# EAGLE design tracker (EAGLE 7.2.0)
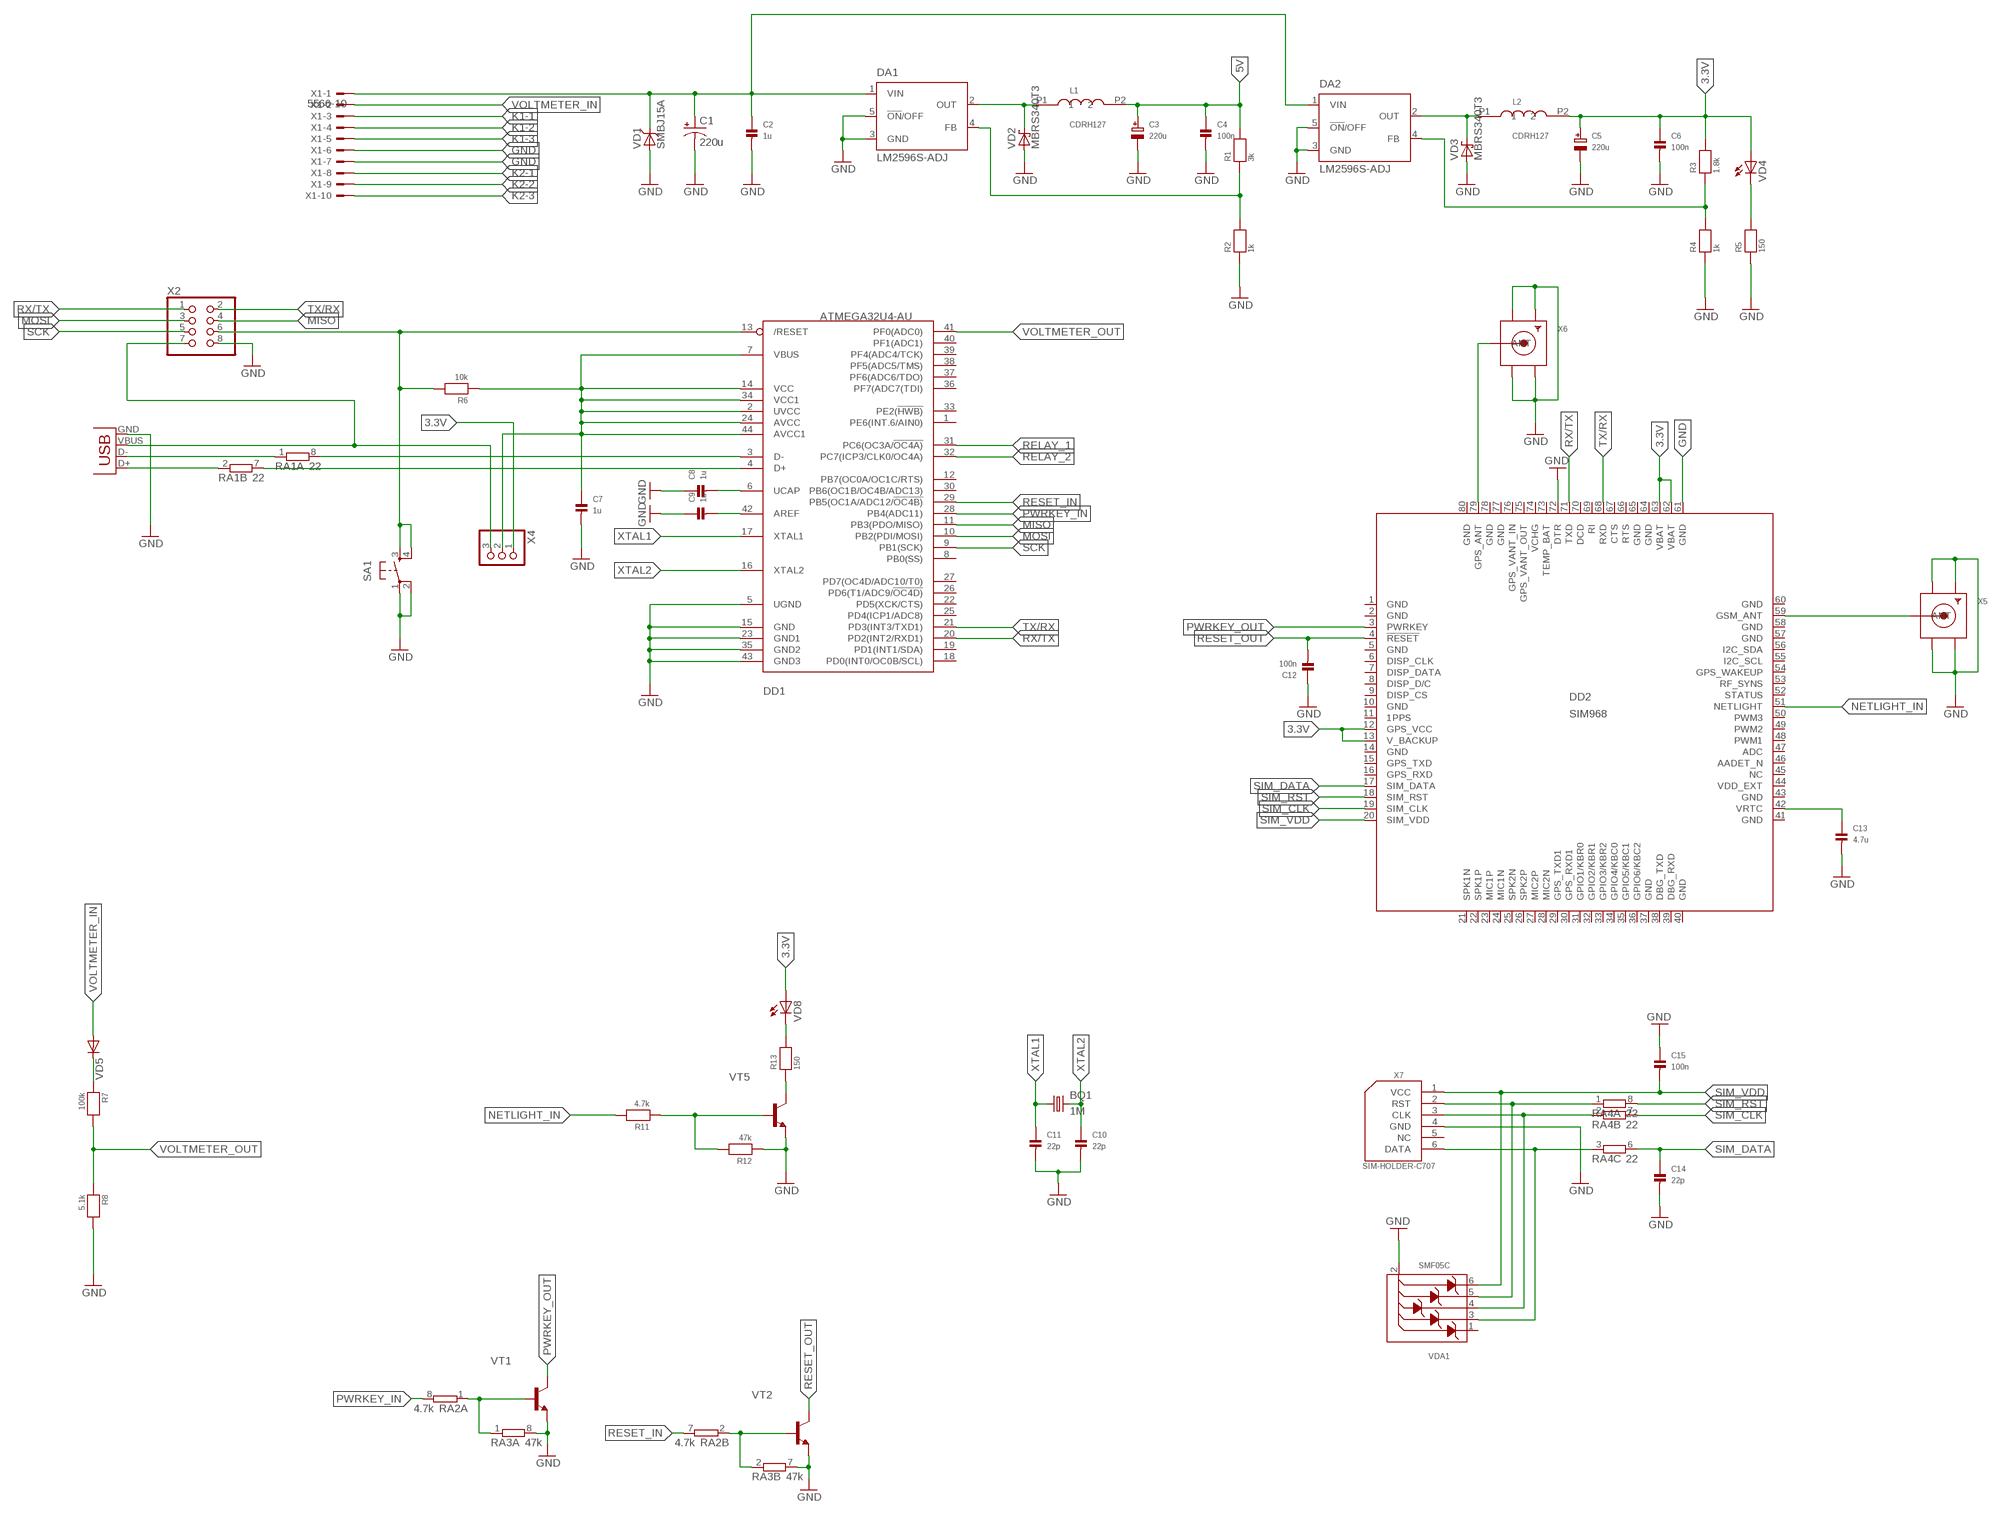
[diagram p0: schematic, sheet 1, part 1 of 2]
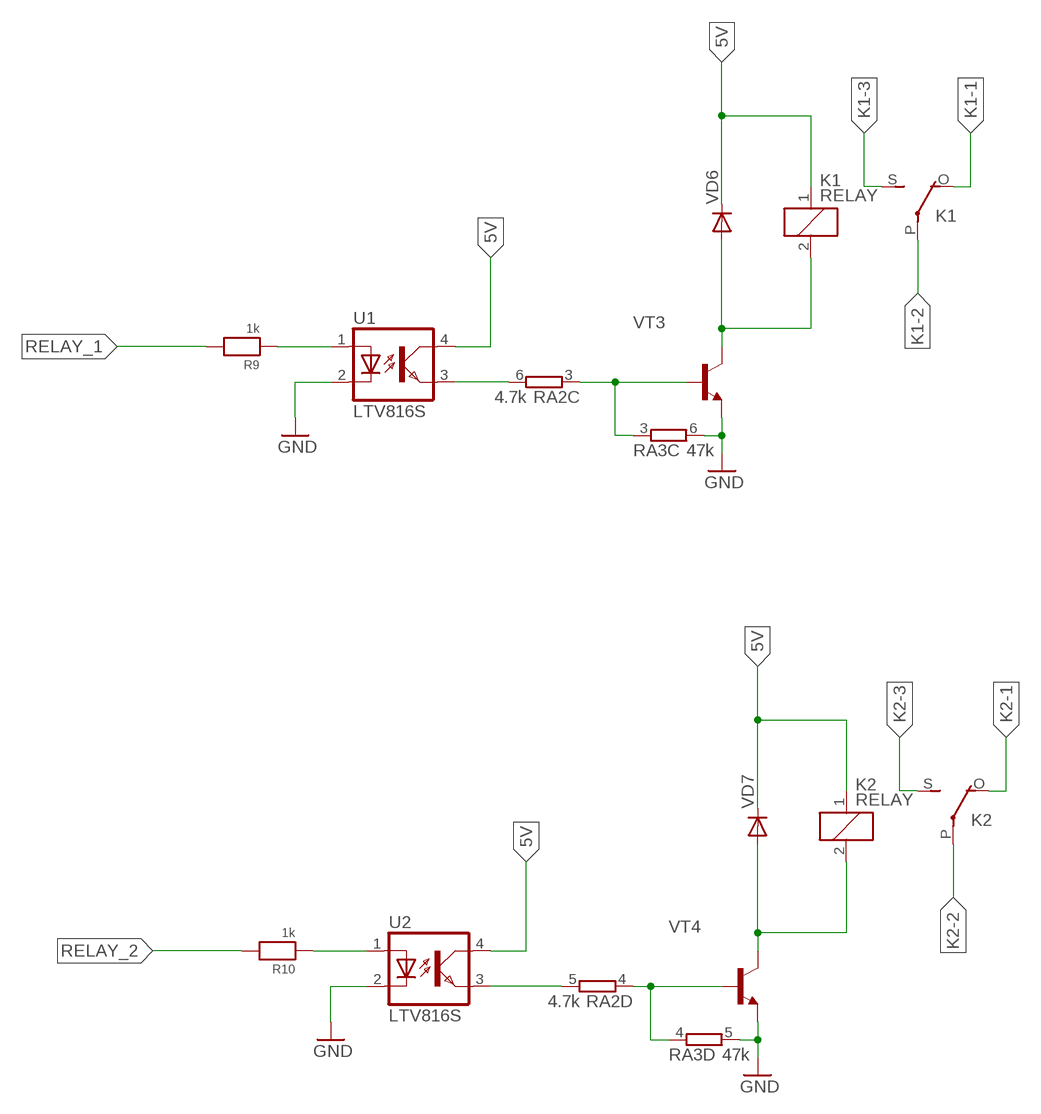
[diagram p1: schematic, sheet 1, part 2 of 2]

## Parts
BQ1  1M  CRYSTALSM49  [SM49]
C1  220u  CAP_POLG  [PANASONIC_G]
C2  1u  CAP_CERAMIC_0805  [_0805]
C3  220u  CAP_TANTALUMD/7343_WAVE  [EIA7343-31/D-W]
C4  100n  CAP_CERAMIC_0603  [_0603]
C5  220u  CAP_TANTALUMD/7343_WAVE  [EIA7343-31/D-W]
C6  100n  CAP_CERAMIC_0603  [_0603]
C7  1u  CAP_CERAMIC_0805  [_0805]
C8  1u  CAP_CERAMIC_0805  [_0805]
C9  1u  CAP_CERAMIC_0805  [_0805]
C10  22p  CAP_CERAMIC_0805  [_0805]
C11  22p  CAP_CERAMIC_0805  [_0805]
C12  100n  CAP_CERAMIC_0603  [_0603]
C13  4.7u  CAP_CERAMIC_0805  [_0805]
C14  22p  CAP_CERAMIC_0805  [_0805]
C15  100n  CAP_CERAMIC_0603  [_0603]
DA1  LM2596S-ADJ  LM2596S  [TO263-5]
DA2  LM2596S-ADJ  LM2596S  [TO263-5]
DD1  ATMEGA32U4-AU  [TQFP44]
DD2  SIM968  [SIM968]
K1  RELAY  [RELAY]
K2  RELAY  [RELAY]
L1  CDRH127  [CDRH127]
L2  CDRH127  [CDRH127]
R1  3k  RESISTOR_0805  [_0805]
R2  1k  RESISTOR_0805  [_0805]
R3  1.8k  RESISTOR_0805  [_0805]
R4  1k  RESISTOR_0805  [_0805]
R5  150  RESISTOR_0805  [_0805]
R6  10k  RESISTOR_0805  [_0805]
R7  100k  RESISTOR_0805  [_0805]
R8  5.1k  RESISTOR_0805  [_0805]
R9  1k  RESISTOR_0805  [_0805]
R10  1k  RESISTOR_0805  [_0805]
R11  4.7k  RESISTOR_0805  [_0805]
R12  47k  RESISTOR_0805  [_0805]
R13  150  RESISTOR_0805  [_0805]
RA1  22  4R-NCAY16  [CAY16]
RA2  4.7k  4R-NCAY16  [CAY16]
RA3  47k  4R-NCAY16  [CAY16]
RA4  22  4R-NCAY16  [CAY16]
SA1  TAC_SWITCHSMD  [TACTILE_SWITCH_SMD]
U1  LTV816S  [SMD4]
U2  LTV816S  [SMD4]
VD1  SMBJ15A  [SMB]
VD2  MBRS340T3  [SMC]
VD3  MBRS340T3  [SMC]
VD4  LEDCHIPLED_1206  [CHIPLED_1206]
VD5  DIODE-MELF  [MELF-MLL41]
VD6  DIODE-MELF  [MELF-MLL41]
VD7  DIODE-MELF  [MELF-MLL41]
VD8  LEDCHIPLED_1206  [CHIPLED_1206]
VDA1  SMF05C  [SC-88]
VT1  BC817-40-NPN-SOT23-BEC  [SOT23-BEC]
VT2  BC817-40-NPN-SOT23-BEC  [SOT23-BEC]
VT3  BC817-40-NPN-SOT23-BEC  [SOT23-BEC]
VT4  BC817-40-NPN-SOT23-BEC  [SOT23-BEC]
VT5  BC817-40-NPN-SOT23-BEC  [SOT23-BEC]
X1  5566-10  [5566-10]
X2  PINHD-2X4  [2X04]
X3  USB-B  USBPTH  [USB-B-PTH]
X4  PINHD-1X3  [1X03]
X5  SMACONNECTOR  [SMA90_DIP]
X6  SMACONNECTOR  [SMA90_DIP]
X7  SIM-HOLDER-C707  [SIM-HOLDER-C707]

## Nets
3.3V: C5.+ C6.1 DD2.12(GPS_VCC) DD2.13(V_BACKUP) DD2.62(VBAT) DD2.63(VBAT) L2.P2 R3.2 VD4.A VD8.A X4.1
5V: C3.+ C4.1 K1.1 K2.1 L1.P2 R1.2 U1.4(COL) U2.4(COL) VD6.C VD7.C
10-30V: C1.+ C2.1 DA1.1(VIN) DA2.1(VIN) VD1.C X1.1
211: RA2.3 RA3.3 VT3.B
1241F1: R10.1 U2.1(A)
12311: R7.1 VD5.C
23251: RA2.2 RA3.2 VT2.B
123111: C9.2 DD1.42(AREF)
2112331: RA2.4 RA3.4 VT4.B
12112123: K1.2 VD6.A VT3.C
234124124124: C8.2 DD1.6(UCAP)
1241241241241: DD1.4(D+) RA1.7
3234234234324: C7.1 DD1.2(UVCC) DD1.7(VBUS) DD1.14(VCC) DD1.24(AVCC) DD1.34(VCC1) DD1.44(AVCC1) R6.1 X4.2
213413241241241: DD1.3(D-) RA1.8
EWDSFDSF3F: DA1.4(FB) R1.1 R2.2
FDSSS33: RA2.6 U1.3(EMIT)
FDSSS333: K2.2 VD7.A VT4.C
FSDFSSF: R9.1 U1.1(A)
FSS34: RA2.5 U2.3(EMIT)
GND: C1.- C2.2 C3.- C4.2 C5.- C6.2 C7.2 C8.1 C9.1 C10.2 C11.2 C12.1 C13.2 C14.2 C15.1 DA1.3(GND) DA1.5(!ON!/OFF) DA2.3(GND) DA2.5(!ON!/OFF) DD1.5(UGND) DD1.15(GND) DD1.23(GND1) DD1.35(GND2) DD1.43(GND3) DD2.61(GND) DD2.72(DTR) R2.1 R4.1 R5.1 R8.2 R12.1 RA3.5 RA3.6 RA3.7 RA3.8 SA1.1 SA1.2 U1.2(C) U2.2(C) VD1.A VD2.A VD3.A VDA1.2(ANODE) VT1.E VT2.E VT3.E VT4.E VT5.E X1.6 X1.7 X2.8 X3.GND X5.GND1 X5.GND2 X5.GND3 X5.GND4 X6.GND1 X6.GND2 X6.GND3 X6.GND4 X7.4(GND)
HJYJY: DA2.4(FB) R3.1 R4.2
JJYU: RA4.2 VDA1.4(CATODE3) X7.3(CLK)
K1-1: K1.O X1.3
K1-2: K1.P X1.4
K1-3: K1.S X1.5
K2-1: K2.O X1.8
K2-2: K2.P X1.9
K2-3: K2.S X1.10
KYUYU: RA4.3 VDA1.3(CATODE2) X7.6(DATA)
MISO: DD1.11(PB3(PDO/MISO)) X2.4
MOSI: DD1.10(PB2(PDI/MOSI)) X2.3
N$1: R5.2 VD4.C
N$2: R13.1 VT5.C
N$3: R13.2 VD8.C
N$4: R11.1 R12.2 VT5.B
N$5: RA1.1 X3.D-
N$13: DD2.59(GSM_ANT) X5.ANTENNA(ANT)
N$18: RA4.1 VDA1.5(CATODE4) X7.2(RST)
N$20: RA1.2 X3.D+
N$22: DD2.79(GPS_ANT) X6.ANTENNA(ANT)
N$25: C13.1 DD2.42(VRTC)
N$44: X2.7 X3.VBUS X4.3
NETLIGHT_IN: DD2.51(NETLIGHT) R11.2
PWRKEY_IN: DD1.28(PB4(ADC11)) RA2.8
PWRKEY_OUT: DD2.3(PWRKEY) VT1.C
RELAY_1: DD1.31(PC6(OC3A/!OC4A)) R9.2
RELAY_2: DD1.32(PC7(ICP3/CLK0/OC4A)) R10.2
RESET: DD1.13(/RESET) R6.2 SA1.3 SA1.4 X2.6
RESET_IN: DD1.29(PB5(OC1A/ADC12/!OC4B)) RA2.7
RESET_OUT: C12.2 DD2.4(!RESET) VT2.C
RX/TX: DD1.20(PD2(INT2/RXD1)) DD2.71(TXD) X2.1
SCK: DD1.9(PB1(SCK)) X2.5
SDSD32: RA2.1 RA3.1 VT1.B
SFFR112R1: DA2.2(OUT) L2.P1 VD3.C
SIM_CLK: DD2.19(SIM_CLK) RA4.7
SIM_DATA: C14.1 DD2.17(SIM_DATA) RA4.6
SIM_RST: DD2.18(SIM_RST) RA4.8
SIM_VDD: C15.2 DD2.20(SIM_VDD) VDA1.6(CATODE5) X7.1(VCC)
TX/RX: DD1.21(PD3(INT3/TXD1)) DD2.68(RXD) X2.2
VOLTMETER_IN: VD5.A X1.2
VOLTMETER_OUT: DD1.41(PF0(ADC0)) R7.2 R8.1
WF23F23F23F23: DA1.2(OUT) L1.P1 VD2.C
XTAL1: BQ1.1 C11.1 DD1.17(XTAL1)
XTAL2: BQ1.2 C10.1 DD1.16(XTAL2)
Unconnected: DD1.1(PE6(INT.6/AIN0)) DD1.8(PB0(SS)) DD1.12(PB7(OC0A/OC1C/RTS)) DD1.18(PD0(INT0/OC0B/SCL)) DD1.19(PD1(INT1/SDA)) DD1.22(PD5(XCK/CTS)) DD1.25(PD4(ICP1/ADC8)) DD1.26(PD6(T1/ADC9/!OC4D)) DD1.27(PD7(OC4D/ADC10/T0)) DD1.30(PB6(OC1B/OC4B/ADC13)) DD1.33(PE2(!HWB)) DD1.36(PF7(ADC7(TDI)) DD1.37(PF6(ADC6/TDO)) DD1.38(PF5(ADC5/TMS)) DD1.39(PF4(ADC4/TCK)) DD1.40(PF1(ADC1)) DD2.6(DISP_CLK) DD2.7(DISP_DATA) DD2.8(DISP_D/C) DD2.9(DISP_CS) DD2.11(1PPS) DD2.15(GPS_TXD) DD2.16(GPS_RXD) DD2.21(SPK1N) DD2.22(SPK1P) DD2.23(MIC1P) DD2.24(MIC1N) DD2.25(SPK2N) DD2.26(SPK2P) DD2.27(MIC2P) DD2.28(MIC2N) DD2.29(GPS_TXD1) DD2.30(GPS_RXD1) DD2.31(GPIO1/KBR0) DD2.32(GPIO2/KBR1) DD2.33(GPIO3/KBR2) DD2.34(GPIO4/KBC0) DD2.35(GPIO5/KBC1) DD2.36(GPIO6/KBC2) DD2.38(DBG_TXD) DD2.39(DBG_RXD) DD2.44(VDD_EXT) DD2.45(NC) DD2.46(AADET_N) DD2.47(ADC) DD2.48(PWM1) DD2.49(PWM2) DD2.50(PWM3) DD2.52(STATUS) DD2.53(RF_SYNS) DD2.54(GPS_WAKEUP) DD2.55(I2C_SCL) DD2.56(I2C_SDA) DD2.66(RTS) DD2.67(CTS) DD2.69(RI) DD2.70(DCD) DD2.75(GPS_VANT_OUT) DD2.76(GPS_VANT_IN) RA1.3 RA1.4 RA1.5 RA1.6 RA4.4 RA4.5 VDA1.1(CATODE1) X7.5(NC)

## Power pins joined to a net without a drawn wire
GND: DD2.1(GND) DD2.2(GND) DD2.5(GND) DD2.10(GND) DD2.14(GND) DD2.37(GND) DD2.40(GND) DD2.41(GND) DD2.43(GND) DD2.57(GND) DD2.58(GND) DD2.60(GND) DD2.64(GND) DD2.65(GND) DD2.77(GND) DD2.78(GND) DD2.80(GND)
TEMP_BAT: DD2.73(TEMP_BAT)
VCHG: DD2.74(VCHG)

## Library data of the parts
BQ1 = crystal:CRYSTAL: CRYSTAL; OC_FARNELL: unknown; OC_NEWARK: unknown
C1 = SparkFun-Passives:CAP_POL: Capacitor Polarized These are standard SMD and PTH capacitors. Normally 10uF, 47uF, and 100uF in electrolytic and tantalum varieties. Always verify the external diameter of the through hole cap, it varies with capacity, voltage, and manufacturer. The EIA devices should be standard.
C2 C4 C6-C15 = microbuilder:CAP_CERAMIC: Ceramic Capacitors 0402 - 0402 Surface Mount Capacitors 16pF 50V 5% [Digikey: 445-4899-2-ND] 18pF 50V 5% [Digikey: 490-1281-2-ND] 22pF 50V 5% [Digikey: 490-1283-2-ND] 68pF 50V 5% [Digikey: 490-1289-2-ND] 0.1uF 10V 10% [Digikey: 490-1318-2-ND] 1.0uF 6.3V 10% [Digikey: 490-1320-2-ND] 0603 - 0603 Surface Mount Capacitors 16 pF 50V 5% [Digikey: 445-5051-2-ND] 22 pF 50V [Digikey: PCC220ACVTR-ND] 33 pF 50V 5% [Digikey: 490-1415-1-ND] 56pF 50V 5% [Digikey: 490-1421-1-ND] 220pF 50V 5% [Digikey: 445-1285-1-ND] 680 pF 50V 2200 pF 50V 5% C0G [Digikey: 445-1297-1-ND] 5600 pF 100V 5% X7R [Digikey: 478-3711-1-ND] 0.1 µF 25V 10% [Digikey: PCC2277TR-ND] 0.22 µF 16V 10% X7R [Digikey: 445-1318-1-ND] 1.0 µF 25V 10% [Digikey: 445-5146-2-ND] 0603 - RF Specific 3pF 250V +/-0.1pF RF [Digikey: 712-1347-1-ND] 18 pF 250V 5% [Digikey: 478-3505-1-ND or 712-1322-1-ND] 56 pF 250V 5% C0G RF [Digikey: 490-4867-1-ND] 68 pF 250V RF [Digikey: 490-4868-1-ND] 0805 - 0805 Surface Mount Capacitors 220 pF 250V 2% RF Ceramic Capacitor [Digikey: 712-1398-1-ND] 1000 pF 50V 2% NP0 Ceramic Capacitor [Digikey: 478-3760-1-ND] 0.1 µF 25V 10% Ceramic Capacitor [Digikey: PCC1828TR-ND] 1.0 µF 16V 10% Ceramic Capacitor[Digikey: 490-1691-2-ND] 10.0 µF 10V 10% Ceramic Capacitor[Digikey: 709-1228-1-ND] 10.0 uF 16V 10% Ceramic Capacitor [Digikey: 478-5165-2-ND] 47 uF 6.3V 20% Ceramic Capacitor [Digikey: 587-1779-1-ND or 399-5506-1-ND] 1206 - 1206 Surface Mount Capacitors 47uF 10V 20% Ceramic Capacitor [Digikey: 490-5528-1-ND or 399-5508-1-ND or 445-6010-1-ND] 100uF 6.3V -20%, +80% Y5V Ceramic Capacitor (Digikey: 490-4512-1-ND, Mouser: 81-GRM31CF50J107ZE1L)
C3 C5 = microbuilder:CAP_TANTALUM: Tantalum Capacitors Wave footprints have larger pads and are meant to be used for hand soldering. Reflow footprints are optimised for solder paste and a reflow oven. EIA3216-18/A-[R/W] - Size A / 3216-18 / 1206 footprint 4.7µF 25V 10% Tantalum Capacitor 10µF 16V 10% Tantalum Capacitor [Digikey: 495-2236-2-ND] EIA3528-21/B-[R/W] - Size B / 3528-21 47µF 10V 10% Tantalum Capactior [Digikey: 495-2216-1-ND] EIA6032-28/C-[R/W] - Size C / 6032-28 10µF 35V 20% Tantalum Capacitor [Digikey: 495-2285-1-ND] 100µF 16V 10% Tantalum Capactior [Digikey: 399-5214-1-ND]
DA1 DA2 = national-semiconductor:LM2596: SIMPLE SWITCHER® Power Converter 150 kHz 3A Step-Down Voltage Regulator Source: http://www.national.com/ds/LM/LM2596.pdf; MF: NATIONAL SEMICONDUCTOR; MPN: LM2596S-ADJ/NOPB; OC_FARNELL: 9494367; OC_NEWARK: 41K3842
DD1 = adafruit:ATMEGA32U4: http://www.ladyada.net/library/eagle
DD2 = tracker:SIM968: edit this description Auto generated by make-symbol-device-package-bsdl.ulp Rev. 44 Source:
K1 K2 = tracker:RELAY
L1 L2 = MAAV:CDRH127; DIGIKEY: 308-1333-1-ND
R1-R13 = microbuilder:RESISTOR: Resistors 0402 - 0402 Surface Mount Package 22 Ohm 1% 1/16W [Digikey: 311-22.0LRTR-ND] 33 Ohm 5% 1/16W 1.0K 5% 1/16W 1.5K 5% 1/16W 2.0K 1% 1/16W 10.0K 1% 1/16W [Digikey: 311-10.0KLRTR-ND] 10.0K 5% 1/16W [Digikey: RMCF0402JT10K0TR-ND] 12.1K 1% 1/16W [Digikey: 311-22.0LRTR-ND] 100.0K 5% 1/16W 0603 - 0603 Surface Mount Package 0 Ohm 1/10 Watt 1% Resistor 15 Ohm 1/10 Watt 1% Resistor 33 Ohm 1/10 Watt 1% Resistor 49.9 Ohm 1/10 Watt 1% Resistor 100 Ohm 1/10 Watt 1% Resistor 150 Ohm 1/10 Watt 1% Resistor 240 Ohm 1/10 Watt 1% Resistor 390 Ohm 1/10 Watt 1% Resistor 560 Ohm 1/10 Watt 1% Resistor 680 Ohm 1/10 Watt 1% Resistor 750 Ohm 1/10 Watt 1% Resistor 1.0K Ohm 1/10 Watt 1% Resistor 1.5K Ohm 1/10 Watt 1% Resistor 2.0K Ohm 1/10 Watt 1% Resistor 2.2K Ohm 1/10 Watt 1% Resistor 3.3K Ohm 1/10 Watt 1% Resistor 4.7K Ohm 1/10 Watt 1% Resistor 10.0K Ohm 1/10 Watt 1% Resistor 12.0K Ohm 1/10 Watt 1% Resistor 12.1K Ohm 1/10 Watt 1% Resistor 20.0K Ohm 1/10 Watt 1% Resistor 33.0K Ohm 1/10 Watt 1% Resistor 100.0K Ohm 1/10 Watt 1% Resistor 0805 - 0805 Surface Mount Package 0 Ohm 1/8 Watt 1% Resistor 33 Ohm 1/8 Watt 1% Resistor 100 Ohm 1/8 Watt 1% Resistor 150 Ohm 1/8 Watt 1% Resistor 200 Ohm 1/8 Watt 1% Resistor 240 Ohm 1/8 Watt 1% Resistor 330 Ohm 1/8 Watt 1% Resistor 390 Ohm 1/8 Watt 1% Resistor 470 Ohm 1/8 Watt 1% Resistor 1.0K Ohm 1/8 Watt 1% Resistor 1.5K Ohm 1/8 Watt 1% Resistor 2.0K Ohm 1/8 Watt 1% Resistor 4.7K Ohm 1/8 Watt 1% Resistor 5.1K Ohm 1/8 Watt 1% Resistor 5.6K Ohm 1/8 Watt 1% Resistor 10.0K Ohm 1/8 Watt 1% Resistor 22.0K Ohm 1/8 Watt 1% Resistor 33.0K Ohm 1/8 Watt 1% Resistor 100K Ohm 1/8 Watt 1% Resistor 1206 - 1206 Surface Mount Package 2012 - 2010 Surface Mount Package 0.11 Ohm 1/2 Watt 1% Resistor - Digikey: RHM.11UCT-ND
RA1-RA4 = resistor-dil:4R-N: Array Chip Resistor Source: RS Component / Phycomp; OC_FARNELL: unknown; OC_NEWARK: unknown
SA1 = SparkFun-Electromechanical:TAC_SWITCH: Momentary Switch Button commonly used for reset or general input. Spark Fun Electronics SKU : COM-00097 SMT- SWCH-08247; PROD_ID: SWCH-08247
U1 U2 = optocoupler:LTV816: OPTO COUPLER Source: LITEON, LTV816.pdf; OC_FARNELL: unknown; OC_NEWARK: unknown
VD1 = tracker:SMBJ15A
VD2 VD3 = diode:MBRS3*0T3: SCHOTTKY BARRIER RECTIFIER 3.0 AMPERES 20, 30, 40 VOLT Source: MBRS340T3-D.pdf
VD4 VD8 = adafruit:LED: LED OSRAM: - CHIPLED LG R971, LG N971, LY N971, LG Q971, LY Q971, LO R971, LY R971 LH N974, LH R974 LS Q976, LO Q976, LY Q976 LO Q996 - Hyper CHIPLED LW Q18S LB Q993, LB Q99A, LB R99A - SideLED LS A670, LO A670, LY A670, LG A670, LP A670 LB A673, LV A673, LT A673, LW A673 LH A674 LY A675 LS A676, LA A676, LO A676, LY A676, LW A676 LS A679, LY A679, LG A679 - Hyper Micro SIDELED® LS Y876, LA Y876, LO Y876, LY Y876 LT Y87S - SmartLED LW L88C, LW L88S LB L89C, LB L89S, LG L890 LS L89K, LO L89K, LY L89K LS L896, LA L896, LO L896, LY L896 - TOPLED LS T670, LO T670, LY T670, LG T670, LP T670 LSG T670, LSP T670, LSY T670, LOP T670, LYG T670 LG T671, LOG T671, LSG T671 LB T673, LV T673, LT T673, LW T673 LH T674 LS T676, LA T676, LO T676, LY T676, LB T676, LH T676, LSB T676, LW T676 LB T67C, LV T67C, LT T67C, LS T67K, LO T67K, LY T67K, LW E67C LS E67B, LA E67B, LO E67B, LY E67B, LB E67C, LV E67C, LT E67C LW T67C LS T679, LY T679, LG T679 LS T770, LO T770, LY T770, LG T770, LP T770 LB T773, LV T773, LT T773, LW T773 LH T774 LS E675, LA E675, LY E675, LS T675 LS T776, LA T776, LO T776, LY T776, LB T776 LHGB T686 LT T68C, LB T68C - Hyper Mini TOPLED® LB M676 - Mini TOPLED Santana® LG M470 LS M47K, LO M47K, LY M47K Source: http://www.osram.convergy.de/
VD5-VD7 = pel_dipol_comp:DIODE
VDA1 = Simplex-DiscreteSemi:SMF05C: ON Semiconductor SMF05C 5-line transient voltage suppressor array
VT1-VT5 = transistor:*-NPN-: NPN Transistror BF959 corrected 2008.03.06
X1 = con-molex:5566-10: Mini FIT connector 10 pol Source: http://www.molex.com; OC_FARNELL: unknown; OC_NEWARK: unknown
X2 = pinhead:PINHD-2X4: PIN HEADER
X3 = SparkFun-Connectors:USB: USB Connectors USB-B-PTH is fully proven SKU : PRT-00139/CONN-08278 USB-miniB is fully proven SKU : PRT-00587 USB-A-PCB is untested. USB-A-H is throughly reviewed, but untested. Spark Fun Electronics SKU : PRT-00437 USB-B-SMT is throughly reviewed, but untested. Needs silkscreen touching up. USB-A-S has not been used/tested USB-MB-H has not been used/tested USB-MICROB has been used. CONN-09505; PROD_ID: CONN-08278
X4 = pinhead:PINHD-1X3: PIN HEADER
X5 X6 = adafruit:SMACONNECTOR: SMA Connector 90° DIP SMA Connector, 50 Ohm (4UConnector: 07259)
X7 = tracker:SIM-HOLDER-C707

## Board
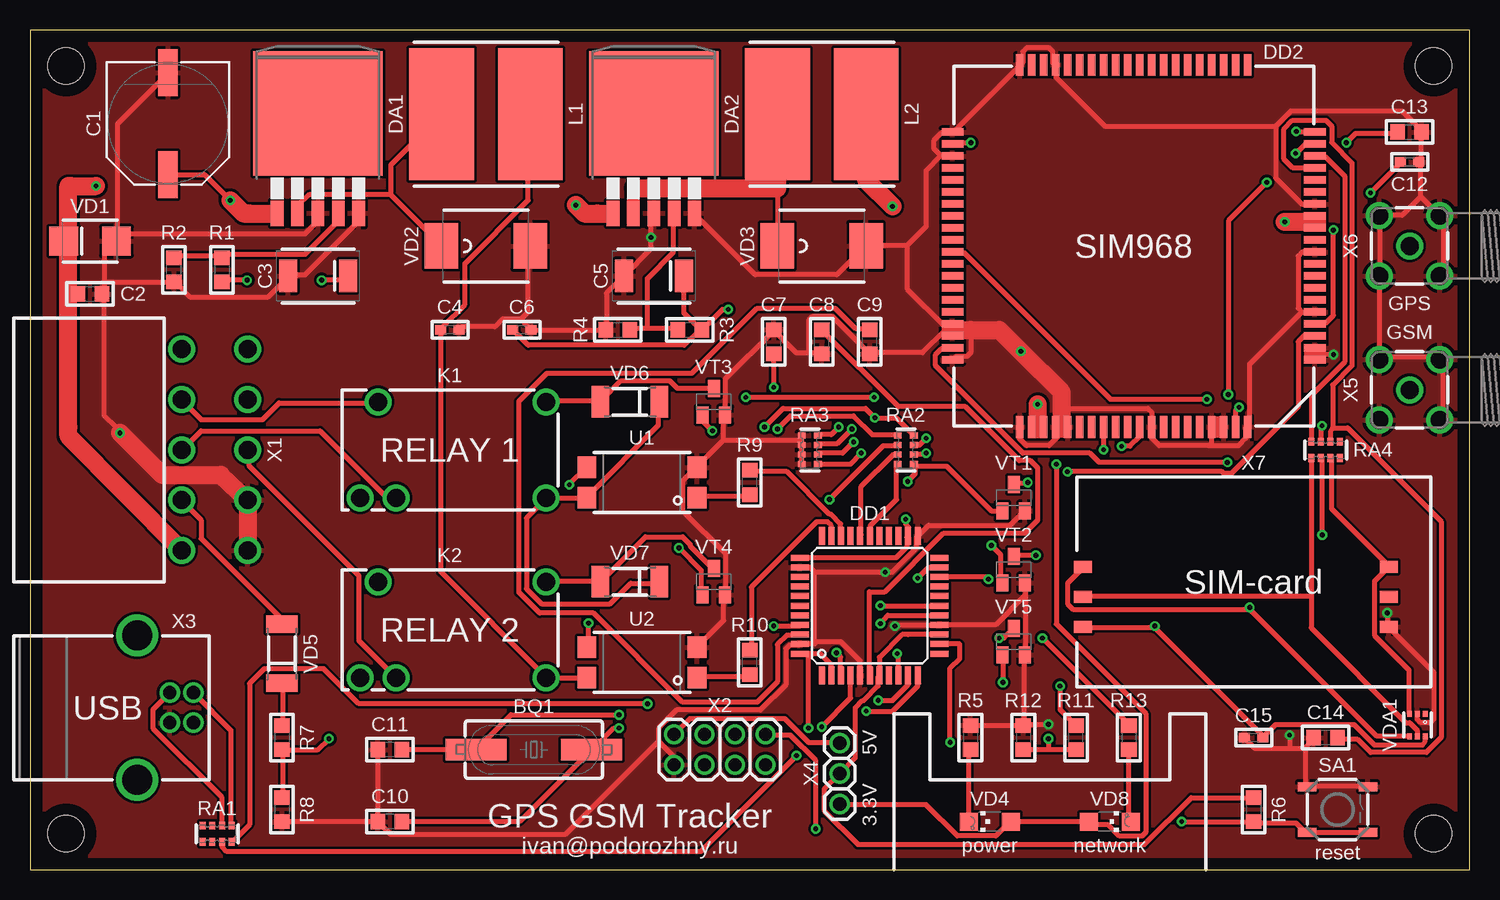
[diagram p2: board, top side]
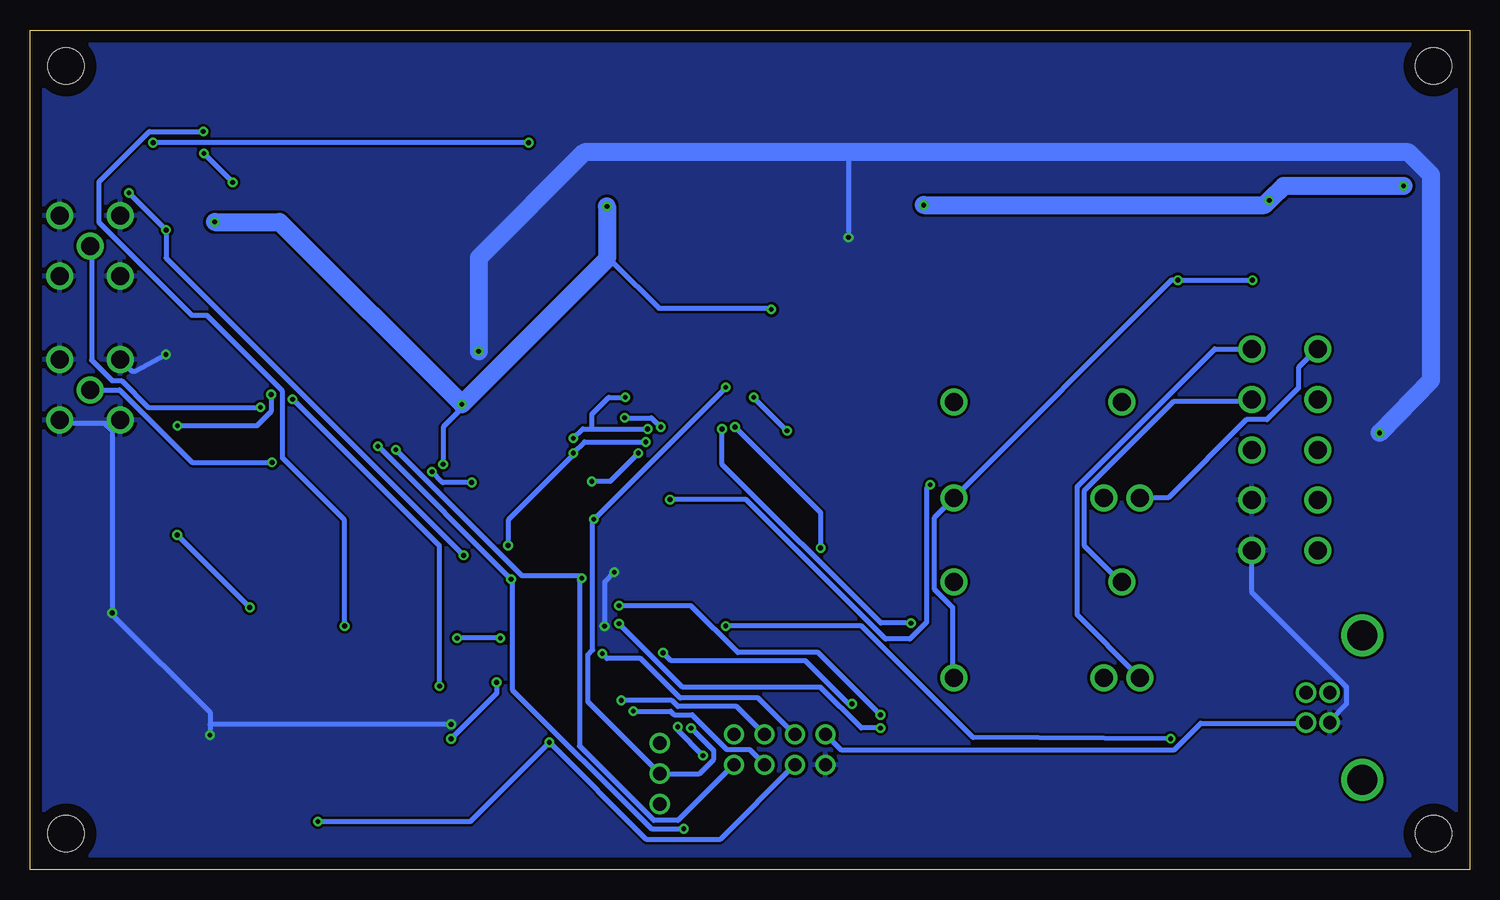
[diagram p3: board, bottom side, seen from below]

Size 120 x 70 mm. Coordinates in mm from the lower left corner, seen from the top.
Outline: 0,0 120,0 120,70 0,70 0,0
Copper layers (1*16): Top 0.035mm / dielectric 1.5mm / Bottom 0.035mm
Design rules "tracker *": minimum track width 0.4mm, minimum drill 0.4mm, track to track 0.22mm, track to pad 0.22mm, pad to pad 0.22mm, via to via 0.22mm, smd to smd 0.22mm, copper to edge 1mm, drill to drill 0.2mm, minimum pad ring 10mil, minimum via ring 8mil, stop-mask expansion 0.05mm, vias tented up to drill 0mil, thermal gap 10mil
Holes 3 mm at 3,67 3,3 117,67 117,3

### Footprints (pad centres in the part's own frame; a part is rotated, then mirrored left to right if it is on the bottom)
SM49 = smd 5.08 x 1.778: 1 -4.826,0; 2 4.826,0
PANASONIC_G = smd 3.9 x 1.6: + 4.25,0; - -4.25,0
_0805 = smd 1.2 x 1.3: 1 -1.016,0; 2 1.016,0
EIA7343-31/D-W = smd 1.5 x 2.7: + 2.5,0; - -2.5,0
_0603 = smd 0.9 x 0.8: 1 -0.762,0; 2 0.762,0
TO263-5 = smd 1.067 x 2.159: 1 -3.404,-5.791; 2 -1.702,-5.791; 3 0,-5.791; 4 1.702,-5.791; 5 3.404,-5.791 | smd 10.8 x 10.41: 6 0,2.54
TQFP44 = smd 1.5 x 0.5: 1 -5.8,4; 2 -5.8,3.2; 3 -5.8,2.4; 4 -5.8,1.6; 5 -5.8,0.8; 6 -5.8,0; 7 -5.8,-0.8; 8 -5.8,-1.6; 9 -5.8,-2.4; 10 -5.8,-3.2; 11 -5.8,-4; 23 5.8,-4; 24 5.8,-3.2; 25 5.8,-2.4; 26 5.8,-1.6; 27 5.8,-0.8; 28 5.8,0; 29 5.8,0.8; 30 5.8,1.6; 31 5.8,2.4; 32 5.8,3.2; 33 5.8,4 | smd 0.5 x 1.5: 12 -4,-5.8; 13 -3.2,-5.8; 14 -2.4,-5.8; 15 -1.6,-5.8; 16 -0.8,-5.8; 17 0,-5.8; 18 0.8,-5.8; 19 1.6,-5.8; 20 2.4,-5.8; 21 3.2,-5.8; 22 4,-5.8; 34 4,5.8; 35 3.2,5.8; 36 2.4,5.8; 37 1.6,5.8; 38 0.8,5.8; 39 0,5.8; 40 -0.8,5.8; 41 -1.6,5.8; 42 -2.4,5.8; 43 -3.2,5.8; 44 -4,5.8
SIM968 = smd 1.8 x 0.6: 1 -15.1,9.5; 2 -15.1,8.5; 3 -15.1,7.5; 4 -15.1,6.5; 5 -15.1,5.5; 6 -15.1,4.5; 7 -15.1,3.5; 8 -15.1,2.5; 9 -15.1,1.5; 10 -15.1,0.5; 11 -15.1,-0.5; 12 -15.1,-1.5; 13 -15.1,-2.5; 14 -15.1,-3.5; 15 -15.1,-4.5; 16 -15.1,-5.5; 17 -15.1,-6.5; 18 -15.1,-7.5; 19 -15.1,-8.5; 20 -15.1,-9.5; 41 15.1,-9.5; 42 15.1,-8.5; 43 15.1,-7.5; 44 15.1,-6.5; 45 15.1,-5.5; 46 15.1,-4.5; 47 15.1,-3.5; 48 15.1,-2.5; 49 15.1,-1.5; 50 15.1,-0.5; 51 15.1,0.5; 52 15.1,1.5; 53 15.1,2.5; 54 15.1,3.5; 55 15.1,4.5; 56 15.1,5.5; 57 15.1,6.5; 58 15.1,7.5; 59 15.1,8.5; 60 15.1,9.5 | smd 0.6 x 1.8: 21 -9.5,-15.1; 22 -8.5,-15.1; 23 -7.5,-15.1; 24 -6.5,-15.1; 25 -5.5,-15.1; 26 -4.5,-15.1; 27 -3.5,-15.1; 28 -2.5,-15.1; 29 -1.5,-15.1; 30 -0.5,-15.1; 31 0.5,-15.1; 32 1.5,-15.1; 33 2.5,-15.1; 34 3.5,-15.1; 35 4.5,-15.1; 36 5.5,-15.1; 37 6.5,-15.1; 38 7.5,-15.1; 39 8.5,-15.1; 40 9.5,-15.1; 61 9.5,15.1; 62 8.5,15.1; 63 7.5,15.1; 64 6.5,15.1; 65 5.5,15.1; 66 4.5,15.1; 67 3.5,15.1; 68 2.5,15.1; 69 1.5,15.1; 70 0.5,15.1; 71 -0.5,15.1; 72 -1.5,15.1; 73 -2.5,15.1; 74 -3.5,15.1; 75 -4.5,15.1; 76 -5.5,15.1; 77 -6.5,15.1; 78 -7.5,15.1; 79 -8.5,15.1; 80 -9.5,15.1
RELAY = drill 1.5 pad 2.1: 1 8,-4; 2 8,4; O -4.5,-4; P -6,4; S -7.5,-4
CDRH127 = smd 5.4 x 11: P1 -3.7,0; P2 3.7,0
CAY16 = smd 0.5 x 0.65: 1 -1.2,-0.675; 2 -0.4,-0.675; 3 0.4,-0.675; 4 1.2,-0.675; 5 1.2,0.675; 6 0.4,0.675; 7 -0.4,0.675; 8 -1.2,0.675
TACTILE_SWITCH_SMD = smd 1.524 x 0.762: 1 -2.54,1.905; 2 2.54,1.905; 3 -2.54,-1.905; 4 2.54,-1.905
SMD4 = smd 1.78 x 1.55: 1 -1.27,-4.6; 2 1.27,-4.6; 3 1.27,4.6; 4 -1.27,4.6
SMB = smd 2.4 x 2.4: A 2.2,0; C -2.2,0
SMC = smd 2.8 x 3.8: A 3.7,0; C -3.7,0
CHIPLED_1206 = smd 1.5 x 1.5: A 0,-1.75; C 0,1.75
MELF-MLL41 = smd 1.45 x 2.6: A 2.445,0; C -2.445,0
SC-88 = smd 0.5 x 0.4: 1 0,1.3; 2 0,0.65; 3 0,0; 4 1.9,0; 5 1.9,0.65; 6 1.9,1.3
SOT23-BEC = smd 1 x 1.4: B -0.95,-1.1; C 0,1.1; E 0.95,-1.1
5566-10 = drill 1.5 pad 2.1: 1 8.4,-2.75; 2 4.2,-2.75; 3 0,-2.75; 4 -4.2,-2.75; 5 -8.4,-2.75; 6 8.4,2.75; 7 4.2,2.75; 8 0,2.75; 9 -4.2,2.75; 10 -8.4,2.75
2X04 = drill 1.1 pad 1.7: 1 -3.81,-1.27; 2 -3.81,1.27; 3 -1.27,-1.27; 4 -1.27,1.27; 5 1.27,-1.27; 6 1.27,1.27; 7 3.81,-1.27; 8 3.81,1.27
USB-B-PTH = drill 1.1 pad 1.7: D+ 0,1.25; D- 1.981,1.25; GND 0,-1.25; VBUS 1.981,-1.25 | drill 2.5 pad 3.1: S1 -2.718,-6.02; S2 -2.718,6.02
1X03 = drill 1.1 pad 1.7: 1 -2.54,0; 2 0,0; 3 2.54,0
SMA90_DIP = drill 1.5 pad 2.1: ANTENNA 0,0; GND1 -2.54,2.54; GND2 2.54,2.54; GND3 -2.54,-2.54; GND4 2.54,-2.54
SIM-HOLDER-C707 = smd 1.5 x 1: 1 14.25,3.75; 2 14.25,1.25; 3 14.25,-1.25; 4 -11.25,3.75; 5 -11.25,1.25; 6 -11.25,-1.25

### Placement (x,y rotation side)
BQ1  42,10 0 top
C1  11.5,62.2 270 top
C2  5,48 0 top
C3  24,49.5 0 top
C4  35,45 0 top
C5  52,49.5 0 top
C6  41,45 0 top
C7  62,44 90 top
C8  66,44 90 top
C9  70,44 90 top
C10  30,4 180 top
C11  30,10 180 top
C12  115,59 180 top
C13  115,61.5 0 top
C14  108,11 180 top
C15  102,11 0 top
DA1  24,60.5 0 top
DA2  52,60.5 0 top
DD1  70,22 90 top
DD2  92,52 180 top
K1  35,35 0 top
K2  35,20 0 top
L1  38,63 0 top
L2  66,63 0 top
R1  16,50 270 top
R2  12,50 90 top
R3  55,45 0 top
R4  49,45 0 top
R5  78.4,11 270 top
R6  102,5 270 top
R7  21,11 270 top
R8  21,5 270 top
R9  60,32.27 90 top
R10  60,17.27 90 top
R11  87.2,11 90 top
R12  82.8,11 270 top
R13  91.6,11 270 top
RA1  15.6,3 180 top
RA2  73,35 90 top
RA3  65,35 90 top
RA4  108,35 0 top
SA1  109,5 0 top
U1  51,32.27 90 top
U2  51,17.27 90 top
VD1  5,52.4 0 top
VD2  38,52 0 top
VD3  66,52 0 top
VD4  80,4 90 top
VD5  21,18 90 top
VD6  50,39 180 top
VD7  50,24 180 top
VD8  90,4 270 top
VDA1  115,13 270 top
VT1  82,31 0 top
VT2  82,25 0 top
VT3  57,39 0 top
VT4  57,24 0 top
VT5  82,19 0 top
X1  15.4,35 270 top
X2  57.5,10 180 top
X3  11.65,13.5 0 top
X4  67.5,8 90 top
X5  115,40 270 top
X6  115,52 270 top
X7  102,24 180 top

### Tracks (layer width: path | path; a pad name or v marks a point on that pad's centre or on a via)
3.3V  (via drill 0.4)
  Top 0.4: C6.1 40.3,44.95 41.54,43.71 54.56,43.71 55.8,44.95 R3.2 55.8,45.1 54.5,46.4 C5.+ | X4.1 67.5,5.4 74.7,5.4 77.3,2.8 80.5,2.8 81.6,3.9 VD4.A VD8.A 88.35,3.72 89.9,3.72 90.83,2.79 92.69,2.79 93,3.1 93,13.02 85.56,20.46 v85.56,33.79 | 84.01,36.5 84.01,36.58 84,36.8 | 84,37.2 84.32,37.2 DD2.63 | 107.5,53.94 107.57,53.94 107.2,54 | DD2.62 83.7,36.89 84,36.89 | DD2.12 107.26,53.63 107.5,53.7 | DD2.13 107.26,54.56 107.5,54.3
  Top 0.406: R3.2 57.72,46.7 v58.2,46.7
  Top 1: 83.7,36.5 84.01,36.5 84.3,36.5 | 107.5,54.3 107.5,53.94 107.5,53.7
  Top 1.5: 84,36.8 84,36.89 84,37.2 v84,38.8 | 107.2,54 v104.6,54 | L2.P2 69.7,57.5 v71.9,55.3
  Bottom 0.4: v58.2,46.7 58.28,46.81 67.58,46.81 71.3,50.53 71.9,50.9 | v85.56,33.79 85.56,36.89 84.32,38.13 v84,38.8
  Bottom 1.5: v104.6,54 99.2,54 v84,38.8 71.9,50.9 v71.9,55.3
5V  (via drill 0.4)
  Top 0.4: U2.4 46.34,15.96 43.09,15.96 K2.1 42.94,16.12 34.26,24.8 34.26,44.95 C4.1 34.41,45.26 36.27,47.12 36.27,50.53 41.54,55.8 41.54,62.93 L1.P2 | v18.09,49.13 16.12,49.13 R1.2 | v24.31,49.13 26.04,49.13 26.35,49.45 C3.+ | VD7.C 52.39,23.87 50.06,23.87 48.36,22.16 42.62,22.16 41.38,23.41 41.38,29.3 42.94,30.84 K1.1 U1.4 46.5,31.16 52.39,37.05 52.39,38.91 VD6.C
  Bottom 0.4: v18.09,49.13 v24.31,49.13 24.86,49.13 K1.1 | 43.09,31 K1.1 | K2.1 43.09,16.12 43.09,21.86 44.64,23.41 44.64,29.3 43.09,30.84 K1.1
10-30V  (via drill 0.4)
  Top 0.4: VD1.C 2.8,49.18 C2.1 3.72,48.05 3.2,48.05 | C1.+ 14.55,57.95 v16.7,55.8 | 3.2,56.42 3.1,56.42 3.4,57 | 3.2,36.89 3.1,36.89 3.2,36.15 | 18.29,54.7 18.29,54.87 17.79,54.71 | 20.3,54.7 20.46,54.87 DA1.1 | 47.3,54.7 47.3,54.71
  Top 0.5: 46.19,54.71 47.3,54.71 DA2.1
  Top 1.5: 3.2,36.15 X1.1 | 3.4,57 v5.5,57 | v16.7,55.8 17.79,54.71 | 46.19,54.71 v45.5,55.4 | 3.2,36.2 3.2,36.89 3.2,48.05 3.2,56.42 3.2,57 | 17.8,54.7 18.29,54.7 20.3,54.7 | 46.2,54.7 47.3,54.7 48.3,54.7
  Bottom 1.5: v5.5,57 15.5,57 v16.7,55.8 17.1,55.4 v45.5,55.4
211  (via drill 0.4)
  Top 0.4: v68.51,36.73 67.27,35.49 65.72,35.49 RA3.3 | v74.71,35.96 74.14,35.4 73.78,35.4 RA2.3 | v56.88,36.58 56.11,37.35 56.11,37.82 VT3.B | v70.37,39.37 v59.67,39.37
  Bottom 0.4: 73.16,36.73 73.94,36.73 v74.71,35.96 | 73.16,36.73 v68.51,36.73 | v59.67,39.37 v56.88,36.58 | v70.37,39.37 71.77,39.37 73.16,37.98 73.16,36.73
1241F1
  Top 0.4: R10.1 59.98,16.12 55.65,16.12 U2.1
12311
  Top 0.4: R7.1 21.08,12.09 21.08,15.5 VD5.C
23251  (via drill 0.4)
  Top 0.4: v68.67,35.65 67.73,34.72 65.72,34.72 RA3.2 | v74.71,34.72 74.58,34.62 RA2.2 | v80.14,27.02 80.91,26.26 80.91,24.02 VT2.B
  Bottom 0.4: v68.67,35.65 73.78,35.65 v74.71,34.72 74.71,34.56 80.14,29.13 v80.14,27.02
123111
  Top 0.4: C9.2 69.91,45.1 68.82,45.1 67.11,46.81 60.6,46.81 55.18,41.38 43.09,41.38 40.77,39.06 40.77,23.09 42.48,21.38 46.98,21.38 54.41,13.95 60.6,13.95 62.31,15.65 62.31,18.75 63.09,19.53 64.17,19.53 DD1.42
2112331  (via drill 0.4)
  Top 0.4: v67.42,36.89 66.81,36.27 65.72,36.27 RA3.4 | 73.62,36.27 RA2.4 72.21,37.66 v70.43,37.66 69.66,38.44 62.77,38.44 v61.23,36.89 | v54.09,26.82 55.95,24.95 55.95,22.94 VT4.B
  Bottom 0.4: v67.42,36.89 68.2,37.66 v70.43,37.66 | v54.09,26.82 54.09,29.76 v61.23,36.89
12112123
  Top 0.4: VT3.C 56.88,40.15 53.94,40.15 53.32,40.77 49.29,40.77 47.59,39.06 VD6.A 47.43,39.06 43.09,39.06 K1.2
234124124124
  Top 0.4: 76.16,28.05 82.92,28.05 84.01,29.14 84.01,33.48 83.39,34.1 82.46,34.1 77.97,38.59 72.39,38.59 66.03,44.95 C8.2 | 69.96,23.16 69.96,16.27 DD1.6
  Top 0.406: 69.96,23.16 71.26,23.16 76.16,28.05
1241241241241  (via drill 0.4)
  Top 0.4: RA1.7 16,1.9 16.4,1.5 55.9,1.5 v63.9,9.5
  Top 0.406: v66,11.9 68.4,14.3 DD1.4
  Bottom 0.406: v63.9,9.5 66,11.6 v66,11.9
3234234234324  (via drill 0.4)
  Top 0.4: DD1.2 66.81,16.27 66.81,17.05 65.88,17.98 64.33,17.98 DD1.44 64.9,17.8 v64.9,11.8 | v62,40.2 C7.1 | v73,29.2 73,28.8 73.2,28.6 DD1.24 73.1,27.7 73.1,26.9 72.2,26 DD1.34 | 70.8,17.7 DD1.7 70.7,16.1 70.7,15.3 69.5,14.1 69.4,14.1 68.8,13.5 68.8,9.3 X4.2 66.2,6.7 66.2,4.9 69,2.1 92.9,2.1 96.8,6 102,6 R6.1 | DD1.14 73.2,19.6
  Top 0.406: 73.2,19.6 72.7,19.6 70.8,17.7
  Bottom 0.4: v62,40.2 v73,29.2 73.1,29.1 73.1,18.3 73.5,17.9 73.5,14 X4.2 64.2,8 63,9.2 63,9.9 v64.9,11.8
213413241241241  (via drill 0.4)
  Top 0.4: v51.48,13.81 27.41,13.81 24.49,16.74 19.53,16.74 18.3,15.51 18.3,3.73 16.89,2.33 RA1.8 | 67.58,16.27 DD1.3
  Top 0.406: 67.58,16.27 67.58,17.71 v67.22,18.07
  Bottom 0.4: v51.48,13.81 51.79,13.81 55.38,17.4
  Bottom 0.406: 55.38,17.4 66.56,17.4 v67.22,18.07
EWDSFDSF3F
  Top 0.4: R2.2 12.09,51.15 15.96,51.15 R1.1 15.96,51.3 22.94,51.3 25.57,53.94 25.57,54.56 DA1.4
FDSSS33  (via drill 0.4)
  Top 0.4: v66.65,30.84 71.14,35.34 72.23,35.34 RA2.6 | v44.95,32.09 46.34,33.48 U1.3
  Bottom 0.4: v66.65,30.84 60.3,30.84 48.67,19.22 46.66,19.22 45.26,20.61 45.26,31.77 v44.95,32.09
FDSSS333
  Top 0.4: VT4.C 56.88,25.11 55.02,26.97 55.02,27.12 54.41,27.75 51.3,27.75 47.59,24.02 VD7.A 47.43,24.02 43.09,24.02 K2.2
FSDFSSF
  Top 0.4: R9.1 59.98,31.16 55.8,31.16 55.65,31 U1.1
FSS34  (via drill 0.4)
  Top 0.4: v62.31,36.73 63.4,37.82 68.67,37.82 70.22,36.27 72.23,36.27 RA2.5 | v46.56,20.55 46.56,19.07 46.5,18.6 U2.3
  Bottom 0.4: v62.31,36.73 62.31,33.79 49.07,20.55 v46.56,20.55
GND  (via drill 0.4)
  Top 0.4: 6.2,51.46 7.13,52.39 VD1.A | 6.04,48.05 C2.2 | VD1.A 7.29,52.55 7.29,62.16 11.47,66.34 C1.- | 106.17,10.07 105,10.07 | 105,10.07 102.14,10.07 101.37,10.85 C15.1 | 106.17,10.07 106.95,10.85 C14.2 | 106.17,10.07 106.33,10.07 106.33,6.97 SA1.1 106.64,6.97 111.44,6.97 SA1.2 | 115.78,58.9 C12.1 | VDA1.2 115.63,12.87 115.63,12.55 115.94,12.24 116.72,12.24 117.03,12.55 117.03,16.43 113.31,20.15 X7.4 113.15,20.46 v113.15,21.39 | U2.2 55.65,18.6 57.81,20.77 57.81,22.79 VT4.E 57.97,23.09 57.97,26.35 54.41,29.91 54.41,32.4 55.49,33.48 U1.2 55.65,33.63 57.81,35.8 | RA3.8 RA3.7 RA3.6 64.33,35.8 | RA3.5 64.33,35.8 | 57.81,35.8 57.81,37.82 VT3.E 57.97,38.13 57.97,40.92 62,44.95 | 57.81,35.8 64.33,35.8 | 115.94,61.53 C13.2 | C12.1 115.94,59.21 115.94,61.38 C13.2 | 115.94,56.11 115.94,58.9 C12.1 | 115.94,56.11 117.49,54.56 X6.GND1 117.8,54.25 117.8,49.6 X6.GND2 | 103.85,62 103.85,57.66 106.02,55.49 106.95,55.49 DD2.14 | 103.85,62 105.09,63.24 114.39,63.24 115.94,61.69 C13.2 | 115.94,56.11 114.39,54.56 112.53,54.56 X6.GND3 112.53,54.25 112.53,49.6 X6.GND4 112.53,49.29 112.53,42.78 | 112.53,42.78 117.49,42.78 X5.GND1 117.8,42.47 117.8,37.51 X5.GND2 | 75.95,59.52 76.88,59.52 DD2.43 | 75.95,59.52 75.33,60.14 75.33,60.76 75.95,61.38 76.88,61.38 DD2.41 77.19,61.69 82.46,66.96 DD2.40 82.77,67.27 82.77,68.2 83.08,68.51 84.94,68.51 85.25,68.2 85.25,67.27 DD2.37 85.56,66.96 85.56,66.03 89.59,62 103.85,62 | DA2.5 55.49,54.56 60.45,49.6 67.27,49.6 69.44,51.77 VD3.A 69.75,52.08 73.16,52.08 | 75.95,59.52 74.71,58.28 74.71,53.63 73.16,52.08 | 106.02,46.5 DD2.5 | 106.02,46.5 105.71,46.81 105.71,51.15 106.02,51.46 106.95,51.46 DD2.10
  Top 0.4: 98.26,35.34 94.14,35.34 93.52,35.96 93.52,36.89 DD2.72 93.51,37.2 93.51,38.13 93.2,38.44 86.49,38.44 86,39.8 | 98.26,35.34 98.47,35.35 98.47,36.89 DD2.77 | DD2.78 98.58,36.89 DD2.77 | 98.26,35.34 100.75,35.34 101.37,35.96 101.37,36.89 DD2.80 101.68,37.2 101.68,42.16 106.02,46.5 | DA1.5 27.28,54.56 27.28,53.94 22.94,49.6 21.7,49.6 C3.- 21.39,49.29 19.84,47.74 13.33,47.74 12.09,48.98 R2.1 11.78,48.98 6.2,48.98 | 6.2,51.46 6.2,48.98 | 6.2,48.98 6.2,48.05 C2.2 | 6.2,51.46 VD1.A | DA1.3 23.87,54.56 23.87,53.94 22.94,53.01 7.44,53.01 VD1.A | 40.92,45.88 39.37,45.88 38.75,45.26 35.96,45.26 C4.2 | 40.92,45.88 41.54,45.26 C6.2 41.85,44.95 47.74,44.95 R4.1 48.05,45.26 48.05,48.05 C5.- 51.77,51.77 v51.77,52.7 51.77,54.56 DA2.3 | 40.92,45.88 41.54,46.5 41.54,51.77 VD2.A | 64.9,43.09 63.86,43.09 62,44.95 | 64.9,43.09 65.72,43.09 C8.1 | 62,44.95 C7.2 | 76.8,45 76.26,44.95 74.4,43.09 70.06,43.09 C9.1 69.9,43.1 66.9,46.1 65.2,46.1 64.9,45.8 64.9,43.09 | 78.43,45 78.43,43.09 78.12,42.78 77.19,42.78 DD2.60 | DD2.61 82.47,36.89 82.47,35.95 83.08,35.34 84.94,35.34 85.87,36.27 86,36.8 | DD2.64 85.56,36.89 86,36.89 | DD2.58 76.88,44.64 76.88,45 76.88,45.57 DD2.57 | DD2.65 86,36.89 | X1.7 18.29,30.69 18.1,30.8 | C2.2 6.2,47.74 6.2,37.82 7.13,36.89 v7.5,36.4 | 73.16,52.08 73.16,48.36 76.26,45.26 DD2.57 | 86,36.4 86,36.89 | DD2.57 76.1,45.6 76.4,45.4 | 98.6,36.4 DD2.77 | 98.6,37.4 98.5,37.1 DD2.77 | 112.53,42.78 112.53,42.61 X5.GND3 | v108.66,42.94 107.54,42.94 107.5,42.9 107.1,43 106.7,43 | DD2.1 107.5,42.7 | DD2.2 107.5,43.3 | v105,11.2 105,10.07 | R5.1 78.4,12 82.8,12 R12.1 | R12.1 82.9,12.1 82.9,17.9 VT5.E 83,18 83,22.8
  Top 0.4: 83,22.8 83,23.9 VT2.E | DD1.15 80.5,20.4 82.9,22.8 83,22.8 | v84.9,12.1 83.1,12.1 R12.1 | C10.2 21,4 R8.2 | C11.2 29,10 29,4.1 C10.2 | VT1.E 82.9,29.9 81.7,28.7 74.9,28.7 DD1.23 73.9,27.7 73.9,26.8 | DD1.5 69.2,17.1 | DD1.35 65,25.2 65.4,24.8 65.4,19 65.4,18.8 DD1.43 64.1,18.7 63.3,18.7 63,18.4 63,15.4 60.9,13.3 53.9,13.3 52.4,11.8 52.4,10.7 | 52.4,10.7 53.6,9.5 53.6,8.8 X2.8 | 52.4,10.7 44.6,2.9 30.1,2.9 29.1,3.9 C10.2
  Top 0.406: 65.4,24.8 v71.3,24.8 71.9,24.8 73.9,26.8 | v72.1,20.3 72.2,20.4 DD1.15 | 69.2,17.1 69.2,17.4 67.6,19 65.4,19
  Top 0.8: 85.6,36.4 86,36.4 86.4,36.4 | 98.6,37.4 99.4,37.4 | 98.6,36.4 99.4,36.4 | 76.4,45.4 76.4,44.6
  Top 1: 106.7,43.3 106.7,43 106.7,42.7 | 107.5,43.3 107.5,42.9 107.5,42.7
  Top 1.5: X1.7 X1.6 | v7.5,36.4 11,32.9 15.9,32.9 18.1,30.8 | 86,36.8 86,36.89 86,39.8 v82.6,43.2 80.8,45 78.43,45 76.88,45 76.8,45
  Bottom 0.4: X1.6 18.14,26.5 18.14,23.09 10.23,15.19 10.23,13.79 11.62,12.4 X3.GND | v108.66,42.94 111.29,41.54 111.46,41.54 X5.GND3 | 113.15,36.58 v113.15,21.39 113.1,21.2 105,13.1 105,12.1 | 113.15,36.58 112.53,37.2 X5.GND4 113.15,36.58 | 113.15,36.58 113.77,37.2 117.49,37.2 X5.GND2 | 51.77,59.8 v51.77,52.7 | 105,12.1 v105,11.2 | v84.9,12.1 105,12.1
  Bottom 0.406: v71.3,24.8 72.1,24 v72.1,20.3
  Bottom 1.5: v7.5,36.4 3.2,40.8 3.2,57.9 5.1,59.8 51.77,59.8 73.8,59.8 82.6,51 v82.6,43.2
  pour Bottom (rank 6): 0,0 120,0 120,70 0,70
  pour Top (rank 6): 0,0 120,0 120,70 0,70
HJYJY
  Top 0.4: 51.46,45.1 53.94,45.1 R3.1 | 51.46,45.1 50.06,45.1 R4.2 | 51.46,45.1 51.46,49.29 53.63,51.46 53.63,54.56 DA2.4
JJYU  (via drill 0.4)
  Top 0.4: 101.68,21.7 112.22,11.16 114.86,11.16 VDA1.4 | 101.68,21.7 86.95,21.7 86.49,22.16 86.49,23.87 87.73,25.11 X7.3 | v107.72,27.9 107.72,34.26 RA4.2 | v101.68,21.86 101.68,21.7
  Bottom 0.4: v101.68,21.86 v107.72,27.9
K1-1
  Top 0.4: K1.O 29.76,31 24.18,36.58 14.26,36.58 12.71,35.03 X1.3
K1-2
  Top 0.4: K1.P 28.98,38.91 20.77,38.91 19.38,37.51 14.26,37.51 12.71,39.06 X1.4
K1-3
  Bottom 0.4: K1.S 25.11,31 18.6,37.51 16.89,37.51 14.26,40.15 14.26,41.85 12.71,43.4 X1.5
K2-1
  Top 0.4: K2.O 27.43,19.07 27.43,24.49 18.29,33.63 18.29,34.88 X1.8
K2-2
  Bottom 0.4: X1.9 18.29,39.06 24.64,39.06 32.09,31.62 32.09,26.97 29.14,24.02 K2.P
K2-3
  Bottom 0.4: X1.10 21.23,43.4 32.7,31.93 32.7,21.23 27.59,16.12 K2.S
KYUYU
  Top 0.4: VDA1.3 114.95,13.02 114.95,16.64 112.06,19.53 112.06,24.02 113.15,25.11 X7.6 113.15,25.42 108.5,30.07 108.5,34.26 RA4.3
MISO  (via drill 0.4)
  Top 0.4: DD1.11 74,15.3 71.9,13.2 v69.7,13.2
  Bottom 0.4: 64.6,12.7 61.9,10 60,10 58.8,8.8 X2.4
  Bottom 0.406: v69.7,13.2 66.6,13.2 66.3,12.9 64.8,12.9 64.6,12.7
MOSI  (via drill 0.4)
  Top 0.4: DD1.10 73.2,15.4 71.9,14.1 v70.7,14.1
  Bottom 0.4: v70.7,14.1 66.5,14.1 66,13.6 61.1,13.6 X2.3
N$1
  Top 0.4: R5.2 78.28,9.92 78.28,4.03 VD4.C
N$2  (via drill 0.4)
  Top 0.4: v84.4,19.3 91.6,12.1 R13.1 | v80.8,19.3 81.2,19.3 VT5.C
  Bottom 0.4: v80.8,19.3 v84.4,19.3
N$3
  Top 0.4: R13.2 91.61,9.92 91.61,4.03 VD8.C
N$4  (via drill 0.4)
  Top 0.4: R12.2 82.8,10 84.9,10 87.2,10 R11.1 | 81.1,17.9 VT5.B
  Top 0.406: 81.1,17.9 v81.1,15.6 | v84.9,10.9 84.9,10
  Bottom 0.406: v81.1,15.6 81.1,14.7 v84.9,10.9
N$5
  Top 0.4: RA1.1 16.74,3.72 16.74,11.62 13.64,14.72 X3.D-
N$13  (via drill 0.4)
  Top 0.4: v99.82,33.95 89.12,33.95 88.35,34.72 82.77,34.72 75.48,42.01 75.48,42.94 75.95,43.4 76.88,43.4 DD2.59
  Bottom 0.4: v99.82,33.95 106.48,33.95 112.53,39.99 114.86,39.99 X5.ANTENNA
N$18
  Top 0.4: 106.8,22.79 106.8,34.26 RA4.1 | 106.8,22.79 106.8,20.15 114.7,12.24 115.01,12.24 115.63,11.62 115.63,11.16 VDA1.5 | 106.8,22.79 87.89,22.79 X7.2
N$20
  Top 0.4: X3.D+ 10.23,13.33 10.23,11.78 15.96,6.04 15.96,3.72 RA1.2
N$22  (via drill 0.4)
  Top 0.4: v100.8,38.54 100.5,38.24 DD2.79
  Bottom 0.4: v100.8,38.54 110.15,38.54 112.38,40.77 113.15,40.77 114.86,42.47 114.86,51.92 X6.ANTENNA
N$25  (via drill 0.4)
  Top 0.4: v109.74,60.6 110.52,61.38 113.92,61.38 C13.1 | v78.43,60.6 77.03,60.6 DD2.42
  Bottom 0.4: v78.43,60.6 v109.74,60.6
N$44
  Top 0.4: X4.3 67.5,10.6 64.9,10.6 62.9,12.6 55,12.6 53.7,11.3 X2.7
  Bottom 0.4: X3.VBUS 13.7,12.2 22.4,12.2 24.6,10 52.4,10 53.6,11.2 X2.7
NETLIGHT_IN  (via drill 0.4)
  Top 0.4: v98.11,39.22 90.06,39.22 77.81,51.46 77.03,51.46 DD2.51 | 87.27,12.09 R11.2 85.86,13.35 v85.86,15.29
  Bottom 0.4: v98.11,39.22 85.86,26.96 v85.86,15.29
PWRKEY_IN
  Top 0.4: RA2.8 72.23,33.79 72.23,30.84 70.06,28.68 70.06,27.9 DD1.28
PWRKEY_OUT  (via drill 0.4)
  Top 0.4: v86.49,33.17 99.36,33.17 99.51,33.02 100.13,33.02 105.71,38.59 105.71,44.02 106.17,44.48 106.95,44.48 DD2.3 | VT1.C 82.15,32.24 83.15,32.24 v83.18,32.27
  Bottom 0.4: v83.18,32.27 85.59,32.27 v86.49,33.17
RELAY_1
  Top 0.4: R9.2 60.14,33.17 63.09,33.17 66.65,29.61 66.81,29.61 67.58,28.83 67.58,27.9 DD1.31
RELAY_2
  Top 0.4: R10.2 60.14,18.29 60.14,23.56 65.56,28.98 66.5,28.98 66.81,28.68 66.81,27.9 DD1.32
RESET  (via drill 0.4)
  Top 0.4: SA1.4 111.44,3.1 106.64,3.1 SA1.3 106.33,3.1 105.56,3.88 102.14,3.88 R6.2 101.8,4 v96,4
  Top 0.406: v76.7,10.6 76.7,16.8 77.5,17.6 77.5,18.8 DD1.13
  Bottom 0.4: 68.2,2.5 62.5,2.5 56.3,8.7 X2.6
  Bottom 0.406: 68.2,2.5 68.6,2.5 v76.7,10.6 83.3,4 v96,4
RESET_IN
  Top 0.4: RA2.7 72.23,34.56 71.92,34.56 69.28,31.93 69.28,27.9 DD1.29
RESET_OUT  (via drill 0.4)
  Top 0.4: v111.75,56.42 114.23,58.9 C12.2 | v108.66,53.32 108.66,46.19 108.03,45.57 107.11,45.57 DD2.4 | v83.86,26.2 82.15,26.2 VT2.C
  Bottom 0.4: v111.75,56.42 v108.66,53.32 108.66,50.99 v83.86,26.2
RX/TX  (via drill 0.4)
  Top 0.4: DD1.20 79.7,24.4 v79.9,24.2 | v91,35.3 91.7,35.3 92.5,36.1 DD2.71 | v65.5,3.4 65.5,9.1 63.4,11.2 61.4,11.2 X2.1
  Bottom 0.4: v91,35.3 v79.9,24.2 79.8,24.1 79.8,15 68.2,3.4 v65.5,3.4
SCK  (via drill 0.4)
  Top 0.406: DD1.9 72.4,17.9 v72.3,18
  Bottom 0.4: 69.1,17.6 65.8,14.3 59.3,14.3 56.3,11.3 X2.5
  Bottom 0.406: 69.1,17.6 71.9,17.6 v72.3,18
SDSD32  (via drill 0.4)
  Top 0.4: v69.28,34.72 68.36,33.79 65.72,33.79 RA3.1 | 73.62,33.79 RA2.1 73.78,33.63 | 73.78,33.63 76.42,33.63 80.14,29.91 80.91,29.91 VT1.B | 73.78,33.63 73.78,32.98 v73.16,32.36
  Bottom 0.4: v69.28,34.72 71.64,32.36 v73.16,32.36
SFFR112R1
  Top 0.4: 62.3,56.8 VD3.C | 50.3,56.11 50.53,56.11 50.53,56.8 | 50.3,54.87 50.53,54.87 DA2.2
  Top 1.1: DA2.2 50.3,54.87 50.3,56.11 50.3,56.9
  Top 1.5: L2.P1 62.3,56.8 50.53,56.8 50.5,56.8
SIM_CLK  (via drill 0.4)
  Top 0.4: RA4.7 107.6,36.9 v107.7,37 | v99.9,39.6 99.9,54.1 v103.1,57.3 | v105.5,59.7 106.3,60.5 DD2.19
  Bottom 0.4: v107.7,37 101.1,37 99.9,38.2 v99.9,39.6 | v105.5,59.7 v103.1,57.3
SIM_DATA
  Top 0.4: 108.6,36.83 108.6,40.4 110.2,42.01 110.2,58.9 108.5,60.6 108.5,62 108.03,62.47 105.25,62.47 104.53,61.74 104.53,59.24 105.28,58.49 106.95,58.49 DD2.17 | 108.6,36.83 108.4,36.51 RA4.6 | 108.6,36.83 109.84,36.83 117.64,29.02 117.64,11.01 116.41,9.77 111.75,9.77 110.67,10.85 109.12,10.85 C14.1
SIM_RST
  Top 0.4: RA4.8 106.8,35.8 106.8,39.52 109.58,42.31 109.58,57.81 107.94,59.47 107,59.47 DD2.18
SIM_VDD  (via drill 0.4)
  Top 0.4: VDA1.6 116.31,11.01 116.31,10.7 116.09,10.38 112.06,10.38 110.36,12.09 103.85,12.09 C15.2 102.77,11.16 93.78,20.15 | 93.78,20.15 87.89,20.15 X7.1 | v105.56,61.53 106.95,61.53 DD2.20 | v93.78,20.3 93.78,20.15
  Bottom 0.4: v105.56,61.53 110.05,61.53 114.23,57.35 114.23,53.94 106.48,46.19 105.25,46.19 98.94,39.89 98.94,34.31 93.78,29.14 v93.78,20.3
TX/RX  (via drill 0.4)
  Top 0.4: v89.5,35 DD2.68
  Top 0.406: v74,24.3 74.9,25.2 DD1.21
  Bottom 0.4: 74.2,10.3 68,4.1 66,4.1 61.4,8.7 X2.2 | 79,24.5 v89.5,35 | 74.4,24.5 74.4,24.49 74.09,24.49 v74,24.3
  Bottom 0.406: 74.3,24.5 74.4,24.5 79,24.5 | v74,24.3 74.2,24.1 74.2,10.3
VOLTMETER_IN
  Top 0.4: VD5.A 20.93,20.46 20.93,20.93 14.26,27.59 14.26,29.14 12.71,30.69 X1.2
VOLTMETER_OUT  (via drill 0.4)
  Top 0.4: R8.1 21.08,6.04 21.08,9.92 R7.2 24,9.98 v24.92,10.9 | v62,20.3 64.17,20.3 DD1.41
  Bottom 0.4: v62,20.3 50.69,20.3 41.38,11.01 v24.92,10.9
WF23F23F23F23
  Top 0.4: 30.07,56.27 23.25,56.27 22.32,55.34 22.32,54.72 DA1.2 | 30.07,56.27 34.26,52.08 VD2.C | 30.07,56.27 30.07,58.74 34.26,62.93 L1.P1
XTAL1  (via drill 0.4)
  Top 0.4: C11.1 BQ1.1 37.3,10.1 40.1,12.9 v49.1,12.9 | v70.9,22 DD1.17
  Bottom 0.4: v70.9,22 64.9,22 61,18.1 54.3,18.1 v49.1,12.9
XTAL2  (via drill 0.4)
  Top 0.4: C10.1 40.8,4 46.8,10 BQ1.2 47,10.1 48.7,11.8 v49.1,11.8 | DD1.16 71.5,21.2 v70.9,20.5
  Bottom 0.4: v70.9,20.5 65.6,15.2 54.1,15.2 50.7,11.8 v49.1,11.8

### Text on the board
tPlace: SIM968 | GPS | GSM | RELAY 1 | SIM-card | RELAY 2 | USB | 5V | 3.3V | GPS GSM Tracker | ivan@podorozhny.ru | power | network | reset